# Altium schematic sheet PWR.SchDoc: USB_HUB 3.0
size A1; DrawnBy: Luca Schenetti; Revision: A; SheetNumber: 2; SheetTotal: 10
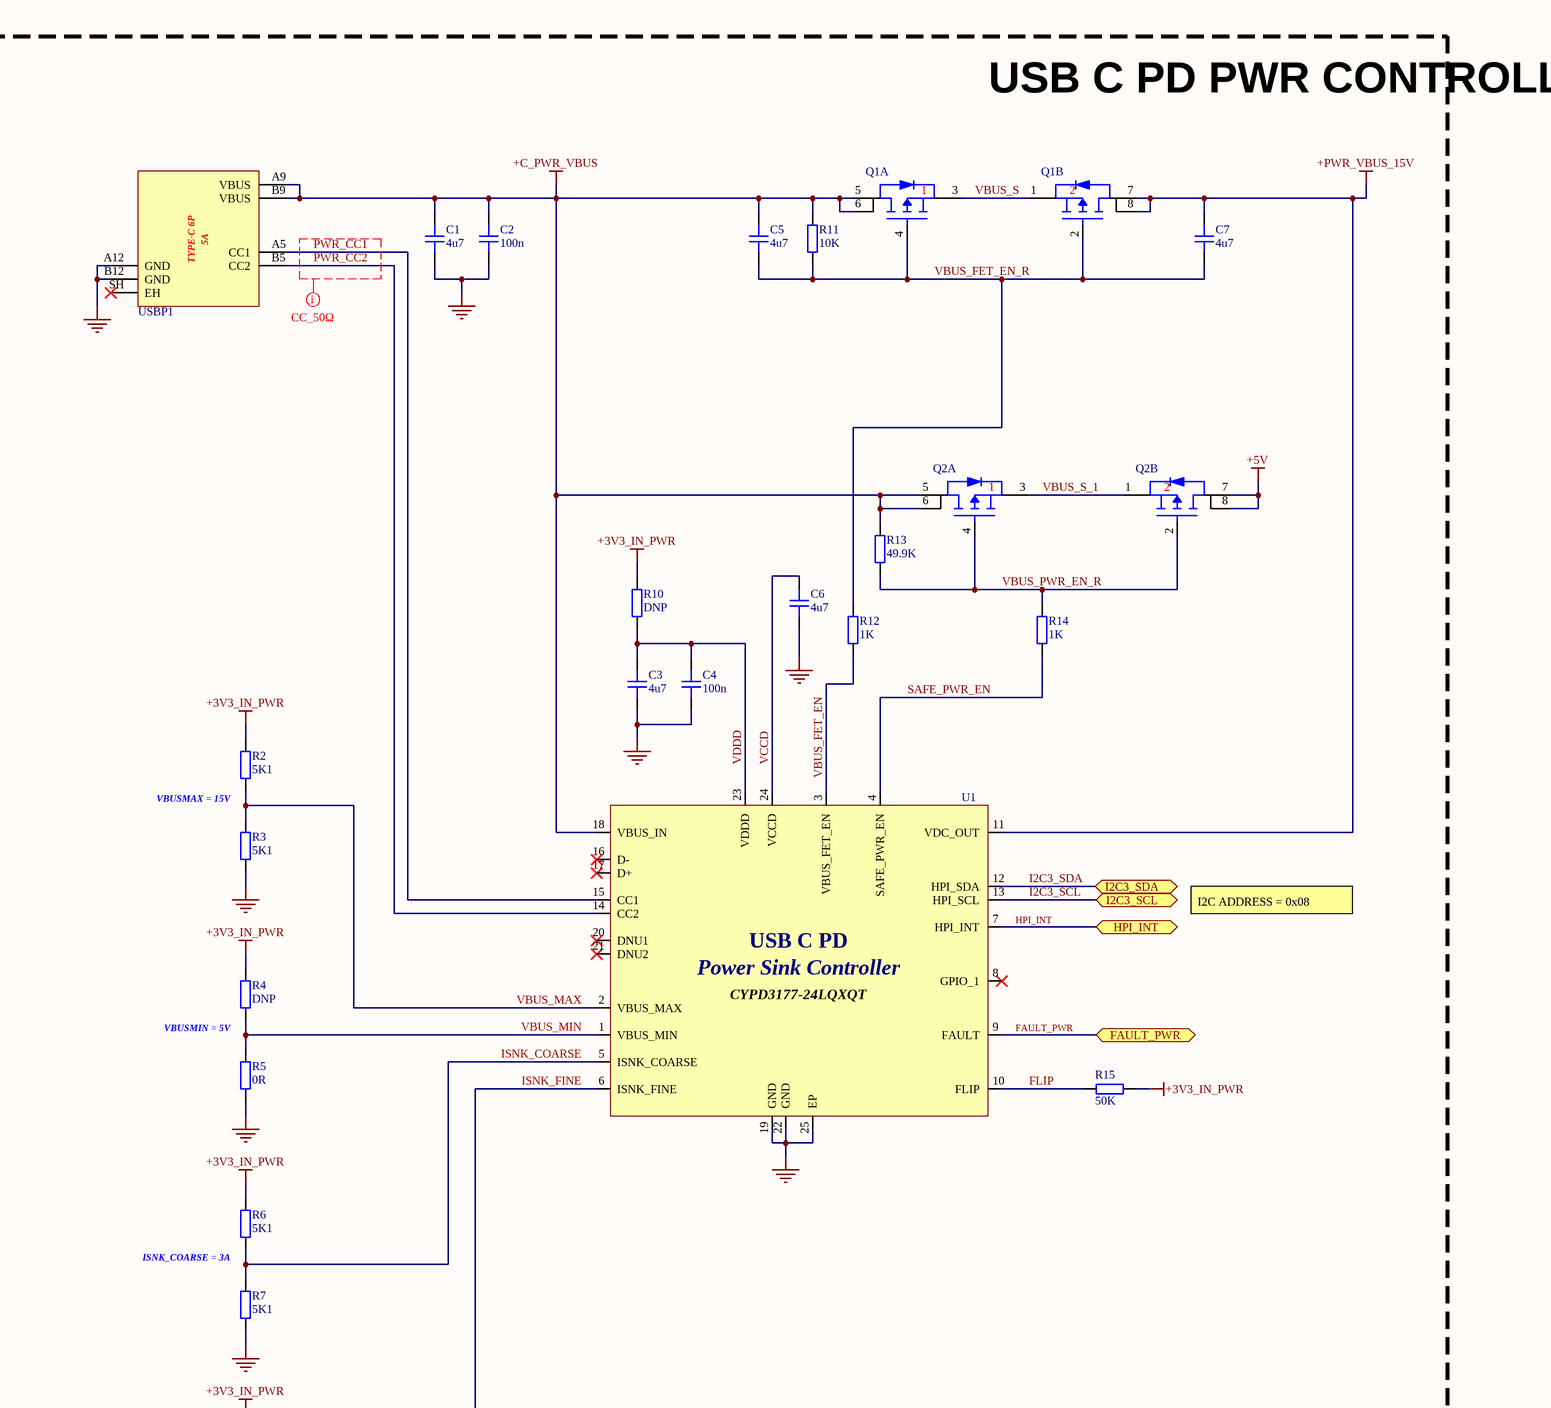
[diagram p0: PWR.SchDoc, top left]
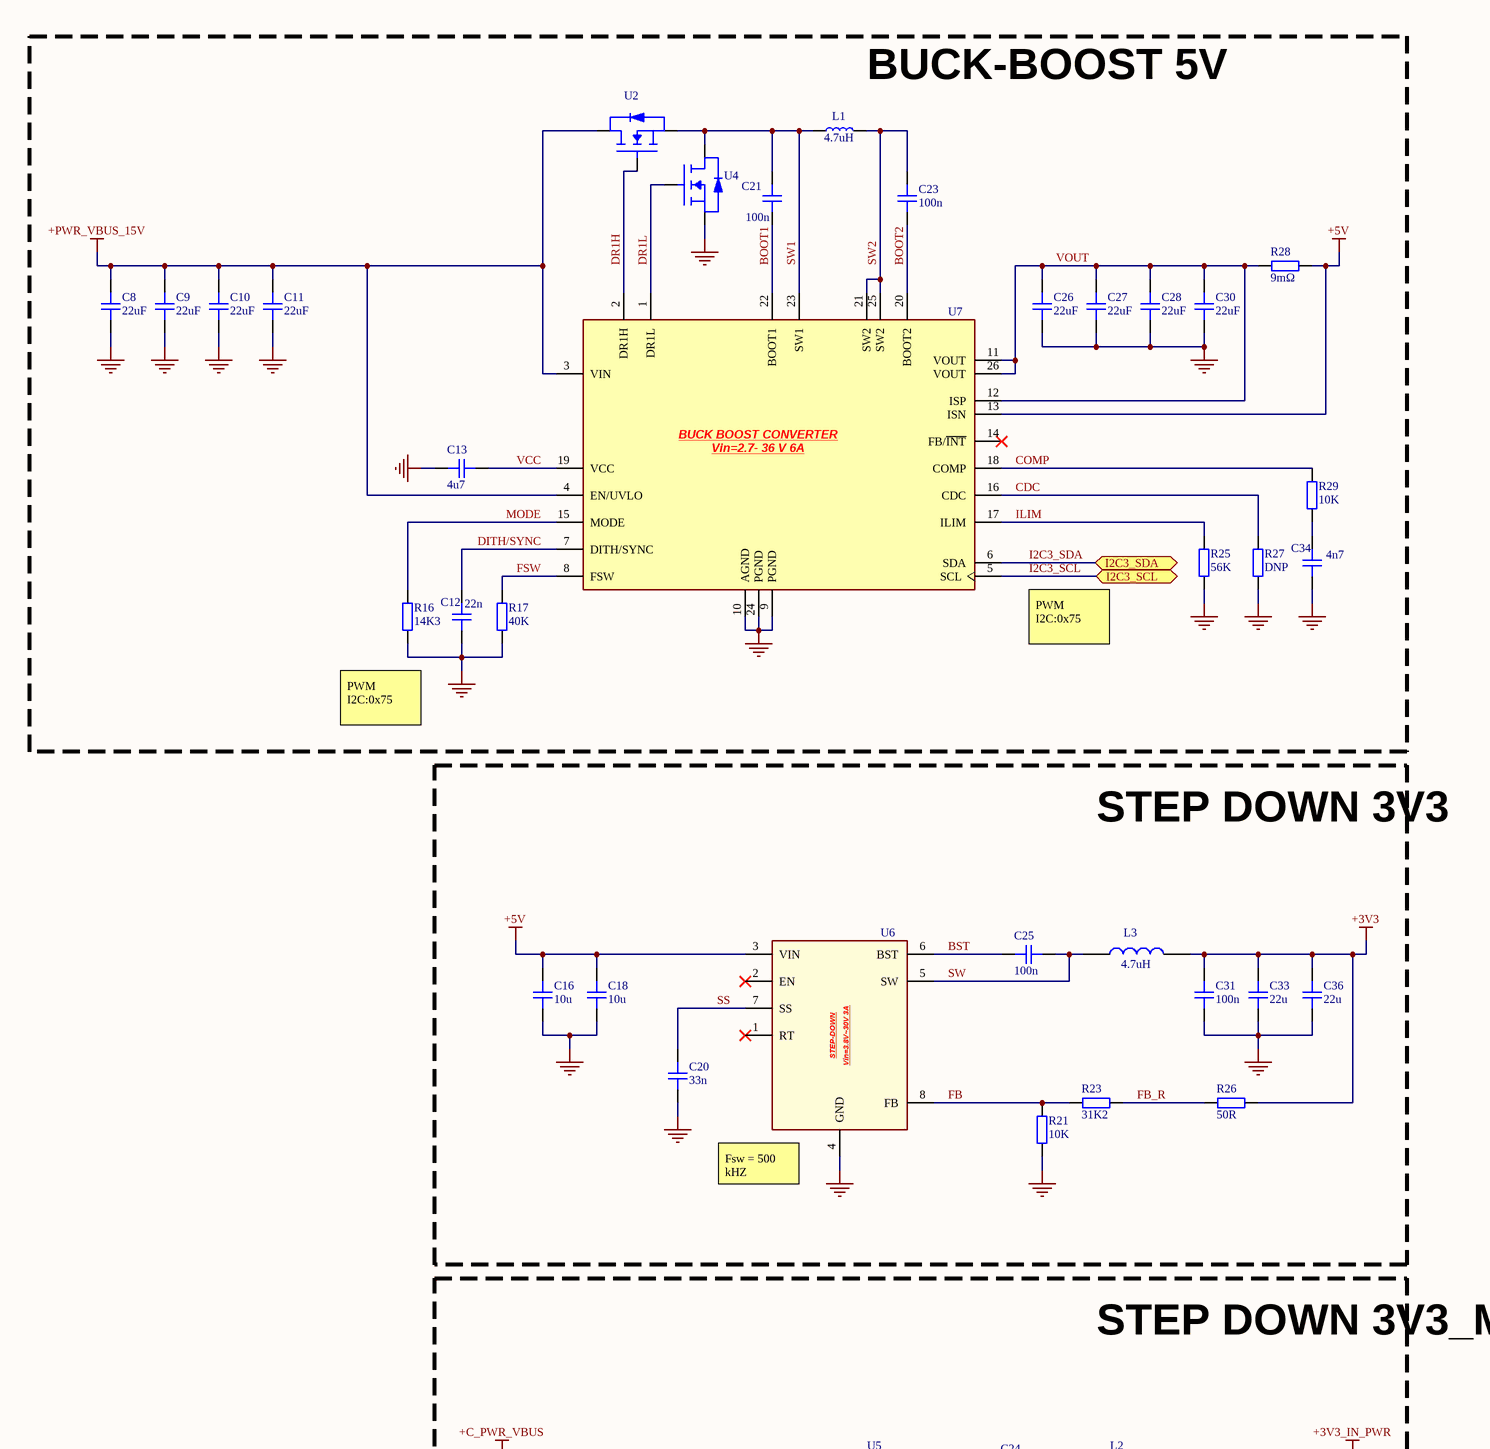
[diagram p1: PWR.SchDoc, top right]
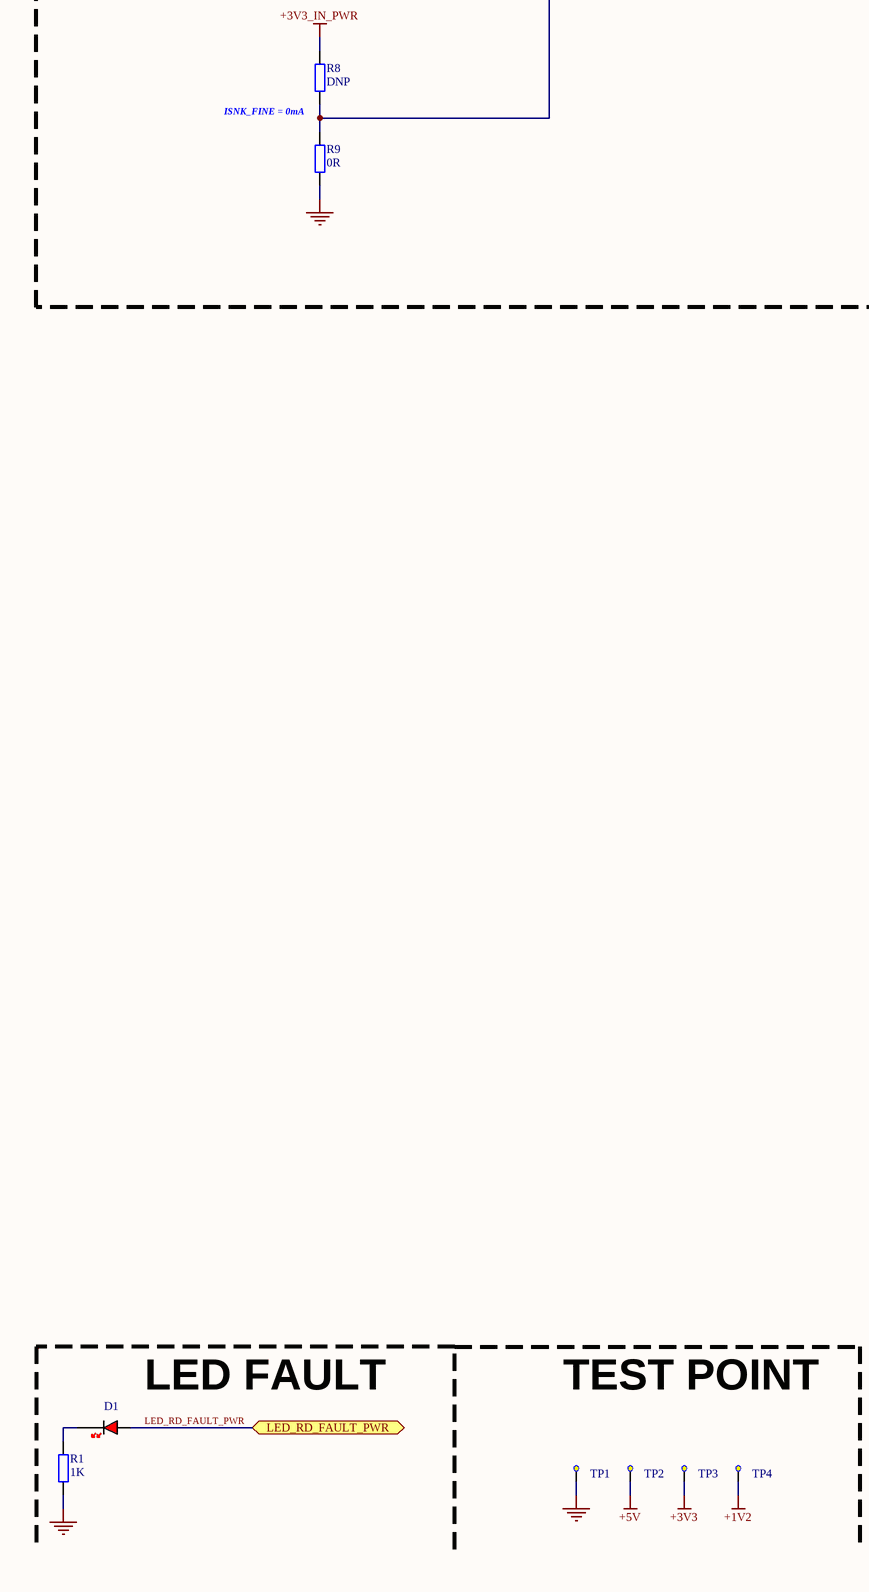
[diagram p2: PWR.SchDoc, bottom left]
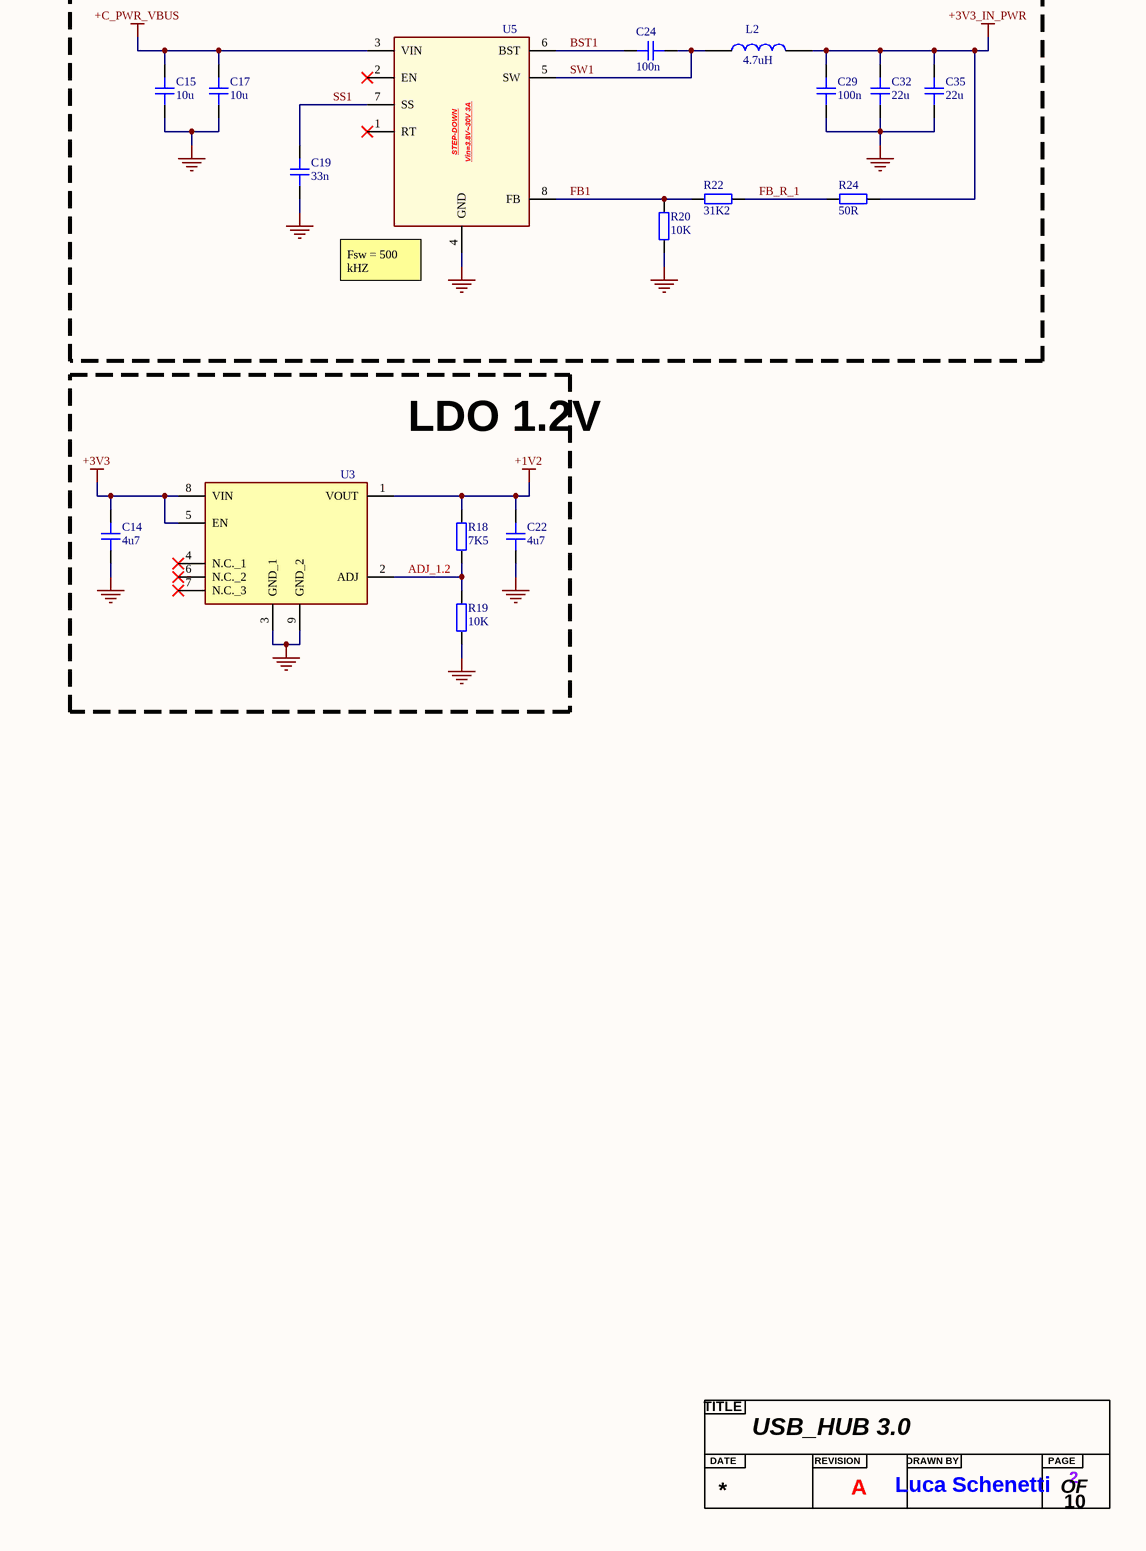
[diagram p3: PWR.SchDoc, bottom right]

## Parts
?  Title  (value not drawn)  (graphical)
C1  4u7  [CAP_0805]
C2  100n  [CAP_0603]
C3  4u7  [CAP_0603]
C4  100n  [CAP_0603]
C5  4u7  [CAP_0805]
C6  4u7  [CAP_0603]
C7  4u7  [CAP_0805]
C8  22uF  [CAP_0805]
C9  22uF  [CAP_0805]
C10  22uF  [CAP_0805]
C11  22uF  [CAP_0805]
C12  22n  [CAP_0603]
C13  4u7  [CAP_0603]
C14  4u7  [CAP_0603]
C15  10u  [CAP_0805]
C16  10u  [CAP_0805]
C17  10u  [CAP_0805]
C18  10u  [CAP_0805]
C19  33n  [CAP_0603]
C20  33n  [CAP_0603]
C21  100n  [CAP_0603]
C22  4u7  [CAP_0603]
C23  100n  [CAP_0603]
C24  100n  [CAP_0603]
C25  100n  [CAP_0603]
C26  22uF  [CAP_0805]
C27  22uF  [CAP_0805]
C28  22uF  [CAP_0805]
C29  100n  [CAP_0603]
C30  22uF  [CAP_0805]
C31  100n  [CAP_0603]
C32  22u  [CAP_0603]
C33  22u  [CAP_0603]
C34  4n7  [CAP_0603]
C35  22u  [CAP_0603]
C36  22u  [CAP_0603]
D1  RED  [LED_0603_RED]  (value not drawn)
L1  4.7uH  [XR0850-4R7M]
L2  4.7uH  [FXL0530-4R7-M]
L3  4.7uH  [FXL0530-4R7-M]
Q1  AO4805  [SOIC-8]  (value not drawn)  (parts A,B of 2)
Q2  AO4805  [SOIC-8]  (value not drawn)  (parts A,B of 2)
R1  1K  [RES_0402]
R2  5K1  [RES_0603]
R3  5K1  [RES_0603]
R4  DNP  [RES_0603]  (no BOM)
R5  0R  [RES_0603]
R6  5K1  [RES_0603]
R7  5K1  [RES_0603]
R8  DNP  [RES_0603]  (no BOM)
R9  0R  [RES_0603]
R10  DNP  [RES_0603]  (no BOM)
R11  10K  [RES_0603]
R12  1K  [RES_0603]
R13  49.9K  [RES_0603]
R14  1K  [RES_0603]
R15  50K  [RES_0603]
R16  14K3  [RES_0603]
R17  40K  [RES_0603]
R18  7K5  [RES_0603]
R19  10K  [RES_0603]
R20  10K  [RES_0603]
R21  10K  [RES_0603]
R22  31K2  [RES_0603]
R23  31K2  [RES_0603]
R24  50R  [RES_0603]
R25  56K  [RES_0603]
R26  50R  [RES_0603]
R27  DNP  [RES_0603]  (no BOM)
R28  9mΩ  [RES_1206]
R29  10K  [RES_0603]
TP1  Test Point  [Test Point]  (value not drawn)
TP2  Test Point  [Test Point]  (value not drawn)
TP3  Test Point  [Test Point]  (value not drawn)
TP4  Test Point  [Test Point]  (value not drawn)
U1  Power Sink Controller  [CYPD3177-24LQXQT]  (value not drawn)
U2  Mosfet N-Channel  Vgs=20V Id=48A  [AON6220]  (value not drawn)
U3  LDO ADJ 2A  [MD7672B50SF4]  (value not drawn)
U4  Mosfet N-Channel  Vgs=20V Id=48A  [AON6220]  (value not drawn)
U5  Step Down Converter 3A 3.8V~30V  [TPS62933DRLR]  (value not drawn)
U6  Step Down Converter 3A 3.8V~30V  [TPS62933DRLR]  (value not drawn)
U7  Buck-Boost Converter 6.35 A  [TPS55288RPMR]  (value not drawn)
USBP1  USB Type-C 5A 6P  [USB-TYPE-C-009]  (value not drawn)

## Blocks framed on the sheet
USB C PD PWR CONTROLLER: C1-C7 Q1 Q2 R2-R15 U1 USBP1
BUCK-BOOST 5V: C8-C13 C21 C23 C26-C28 C30 C34 L1 R16 R17 R25 R27-R29 U2 U4 U7
STEP DOWN 3V3: C16 C18 C20 C25 C31 C33 C36 L3 R21 R23 R26 U6
STEP DOWN 3V3_MCU: C15 C17 C19 C24 C29 C32 C35 L2 R20 R22 R24 U5
LDO 1.2V: C14 C22 R18 R19 U3

## Ports
FAULT_PWR (bidir, see MCU[2D]), HPI_INT (bidir, see MCU[2C]), I2C3_SCL (bidir, see MCU[2C], PWR[4B], USB_HUB1 DN PORT 1_2[5B], USB_HUB1 DN PORT 1_2[5D], USB_HUB1 UP PORT0[5B]), I2C3_SCL (bidir, see MCU[2C], PWR[11A], USB_HUB1 DN PORT 1_2[5B], USB_HUB1 DN PORT 1_2[5D], USB_HUB1 UP PORT0[5B]), I2C3_SDA (bidir, see MCU[4C], PWR[4B], USB_HUB1 DN PORT 1_2[5B], USB_HUB1 DN PORT 1_2[5D], USB_HUB1 UP PORT0[5B]), I2C3_SDA (bidir, see MCU[4C], PWR[11A], USB_HUB1 DN PORT 1_2[5B], USB_HUB1 DN PORT 1_2[5D], USB_HUB1 UP PORT0[5B]), LED_RD_FAULT_PWR (bidir, see MCU[1D])

## Nets
+1V2: C22.2 R18.2 TP4.1(Test_Point) U3.1(VOUT)
+3V3: C14.2 C31.1 C33.2 C36.2 L3.2 R26.1 TP3.1(Test_Point) U3.5(EN) U3.8(VIN)
+3V3_IN_PWR: C29.1 C32.2 C35.2 L2.2 R2.2 R4.2 R6.2 R8.2 R10.2 R15.2 R24.1
+5V: C16.2 C18.2 Q2.7(D2) Q2.8(D2) R28.2 TP2.1(Test_Point) U6.3(VIN) U7.13(ISN)
+C_PWR_VBUS: C1.2 C2.2 C5.2 C15.2 C17.2 Q1.5(D1) Q1.6(D1) Q2.5(D1) Q2.6(D1) R11.2 R13.2 U1.18(VBUS_IN) U5.3(VIN) USBP1.A9(VBUS) USBP1.B9(VBUS)
+PWR_VBUS_15V: C7.2 C8.2 C9.2 C10.2 C11.2 Q1.7(D2) Q1.8(D2) U1.11(VDC_OUT) U2.D U7.3(VIN) U7.4(EN/UVLO)
GND: C1.1 C2.1 C3.1 C4.1 C6.1 C8.1 C9.1 C10.1 C11.1 C12.1 C13.2 C14.1 C15.1 C16.1 C17.1 C18.1 C19.2 C20.2 C22.1 C26.1 C27.1 C28.1 C29.2 C30.1 C31.2 C32.1 C33.1 C34.1 C35.1 C36.1 R1.1 R3.1 R5.1 R7.1 R9.1 R16.1 R17.1 R19.1 R20.1 R21.1 R25.1 R27.1 TP1.1(Test_Point) U1.19(GND) U1.22(GND) U1.25(EP) U3.3(GND_1) U3.9(GND_2) U4.S U5.4(GND) U6.4(GND) U7.9(PGND) U7.10(AGND) U7.24(PGND) USBP1.A12(GND) USBP1.B12(GND)
ADJ_1.2: R18.1 R19.2 U3.2(ADJ)
BOOT1: C21.1 U7.22(BOOT1)
BOOT2: C23.1 U7.20(BOOT2)
BST: C25.2 U6.6(BST)
BST1: C24.2 U5.6(BST)
CDC: R27.2 U7.16(CDC)
COMP: R29.2 U7.18(COMP)
DITH/SYNC: C12.2 U7.7(DITH/SYNC)
DR1H: U2.G U7.2(DR1H)
DR1L: U4.G U7.1(DR1L)
FAULT_PWR: U1.9(FAULT) ; port FAULT_PWR
FB: R21.2 R23.2 U6.8(FB)
FB1: R20.2 R22.2 U5.8(FB)
FB_R: R23.1 R26.2
FB_R_1: R22.1 R24.2
FLIP: R15.1 U1.10(FLIP)
FSW: R17.2 U7.8(FSW)
HPI_INT: U1.7(HPI_INT) ; port HPI_INT
I2C3_SCL: U1.13(HPI_SCL) U7.5(SCL) ; port I2C3_SCL
I2C3_SDA: U1.12(HPI_SDA) U7.6(SDA) ; port I2C3_SDA
ILIM: R25.2 U7.17(ILIM)
ISNK_COARSE: R6.1 R7.2 U1.5(ISNK_COARSE)
ISNK_FINE: R8.1 R9.2 U1.6(ISNK_FINE)
LED_RD_FAULT_PWR: D1.A ; port LED_RD_FAULT_PWR
MODE: R16.2 U7.15(MODE)
PWR_CC1: U1.15(CC1) USBP1.A5(CC1)
PWR_CC2: U1.14(CC2) USBP1.B5(CC2)
SAFE_PWR_EN: R14.1 U1.4(SAFE_PWR_EN)
SS: C20.1 U6.7(SS)
SS1: C19.1 U5.7(SS)
SW: C25.1 L3.1 U6.5(SW)
SW1: C21.2 C24.1 L1.1 L2.1 U2.S U4.D U5.5(SW) U7.23(SW1)
SW2: C23.2 L1.2 U7.21(SW2) U7.25(SW2)
VBUS_FET_EN: R12.1 U1.3(VBUS_FET_EN)
VBUS_FET_EN_R: C5.1 C7.1 Q1.2(G2) Q1.4(G1) R11.1 R12.2
VBUS_MAX: R2.1 R3.2 U1.2(VBUS_MAX)
VBUS_MIN: R4.1 R5.2 U1.1(VBUS_MIN)
VBUS_PWR_EN_R: Q2.2(G2) Q2.4(G1) R13.1 R14.2
VBUS_S: Q1.1(S2) Q1.3(S1)
VBUS_S_1: Q2.1(S2) Q2.3(S1)
VCC: C13.1 U7.19(VCC)
VCCD: C6.2 U1.24(VCCD)
VDDD: C3.2 C4.2 R10.1 U1.23(VDDD)
VOUT: C26.2 C27.2 C28.2 C30.2 R28.1 U7.11(VOUT) U7.12(ISP) U7.26(VOUT)
NetC34_2: C34.2 R29.1
NetD1_K: D1.K R1.2

Not connected (* = marked no-connect by the designer): U1 8(GPIO_1)* 16(D-)* 17(D+)* 20(DNU1)* 21(DNU2)*; U3 4(N.C._1)* 6(N.C._2)* 7(N.C._3)*; U5 1(RT)* 2(EN)*; U6 1(RT)* 2(EN)*; U7 14(FB/~{INT})*; USBP1 SH(EH)*

## Layout directives
net class CC_50Ω: PWR_CC1, PWR_CC2

## Notes on the sheet
- PWM
  I2C:0x75
- VBUSMAX = 15V
- I2C ADDRESS = 0x08
- VBUSMIN = 5V
- (near U6) Fsw = 500 kHZ
- ISNK_COARSE = 3A
- ISNK_FINE = 0mA
- (near U5) Fsw = 500 kHZ
- (near D1) LED FAULT
- TEST POINT
- (in symbol CYPD3177-24LQXQT) USB C PD
- (in symbol Title) TITLE; DATE; REVISION; DRAWN BY; PAGE; OF
- (in symbol TPS55288RPMR) BUCK BOOST CONVERTER; Vin=2.7- 36 V 6A
- (in symbol TPS62933DRLR) STEP-DOWN; Vin=3.8V~30V 3A
- (in symbol USB-TYPE-C-009) TYPE-C 6P; 5A

## Library data of the parts
C1 C5 C7 = CAP_0805: [C1779]; Manufacturer: *; Manufacturer Part Number: *; Distributor Link: *; LCSC: *; Rating: *; Dielectric: *
C2 C4 C21 C23 = CAP_0603: [C14663]; Manufacturer: *; Manufacturer Part Number: *; Distributor Link: *; LCSC: *; Rating: *; Dielectric: *
C3 C13 C14 C22 = CAP_0603: [C19666]; Manufacturer: *; Manufacturer Part Number: *; Distributor Link: *; LCSC: *; Rating: *; Dielectric: *
C6 = CAP_0603: [C69335]; Manufacturer: *; Manufacturer Part Number: *; Distributor Link: *; LCSC: *; Rating: *; Dielectric: *
C8-C11 C26-C28 C30 = CAP_0805: [C45783]; Manufacturer: *; Manufacturer Part Number: *; Distributor Link: *; LCSC: *; Rating: *; Dielectric: *
C12 = CAP_0603: [C21122]; Manufacturer: *; Manufacturer Part Number: *; Distributor Link: *; LCSC: *; Rating: *; Dielectric: *
C15-C18 = CAP_0805: Capacitor SMD 0805[C440198]; Manufacturer: *; Manufacturer Part Number: *; Distributor Link: *; LCSC: *; Rating: *; Dielectric: *
C19 C20 = CAP_0603: [C21117]; Manufacturer: *; Manufacturer Part Number: *; Distributor Link: *; LCSC: *; Rating: *; Dielectric: *
C24 C25 C29 C31 = CAP_0603: Capacitor SMD 0603 [C14663]; Manufacturer: *; Manufacturer Part Number: *; Distributor Link: *; LCSC: *; Rating: *; Dielectric: *
C32 C33 C35 C36 = CAP_0603: Capacitor SMD 0603 [C59461]; Manufacturer: *; Manufacturer Part Number: *; Distributor Link: *; LCSC: *; Rating: *; Dielectric: *
C34 = CAP_0603: [C53987]; Manufacturer: *; Manufacturer Part Number: *; Distributor Link: *; LCSC: *; Rating: *; Dielectric: *
D1 = LED_0603_RED: LED 0603 RED SMD[C2926776]
L1 = XR0850-4R7M: [C7498934]
L2 L3 = FXL0530-4R7-M: [C177246]
Q1 Q2 = AO4805: [C5224317]; Manufacturer: Alpha & Omega Semicon; Manufacturer Part Number: AO4805; LCSC: C38943
R1 = RES_0402: [C11702]; Manufacturer: *; Manufacturer Part Number: *; Distributor Link: *; LCSC: *
R2 R3 R6 R7 = RES_0603: [C23186]; Manufacturer: *; Manufacturer Part Number: *; Distributor Link: *; LCSC: *
R4 R8 R10 R27 = RES_0603: Manufacturer: *; Manufacturer Part Number: *; Distributor Link: *; LCSC: *
R5 R9 = RES_0603: [C21189]; Manufacturer: *; Manufacturer Part Number: *; Distributor Link: *; LCSC: *
R11 R19-R21 R29 = RES_0603: [C25804]; Manufacturer: *; Manufacturer Part Number: *; Distributor Link: *; LCSC: *
R12 R14 = RES_0603: [C21190]; Manufacturer: *; Manufacturer Part Number: *; Distributor Link: *; LCSC: *
R13 = RES_0603: [C23184]; Manufacturer: *; Manufacturer Part Number: *; Distributor Link: *; LCSC: *
R15 = RES_0603: [C861451]; Manufacturer: *; Manufacturer Part Number: *; Distributor Link: *; LCSC: *
R16 = RES_0603: [C2933145]; Manufacturer: *; Manufacturer Part Number: *; Distributor Link: *; LCSC: *
R17 = RES_0603: [C3016445]; Manufacturer: *; Manufacturer Part Number: *; Distributor Link: *; LCSC: *
R18 = RES_0603: [C23234]; Manufacturer: *; Manufacturer Part Number: *; Distributor Link: *; LCSC: *
R22 R23 = RES_0603: [C863036]; Manufacturer: *; Manufacturer Part Number: *; Distributor Link: *; LCSC: *
R24 R26 = RES_0603: [C849792]; Manufacturer: *; Manufacturer Part Number: *; Distributor Link: *; LCSC: *
R25 = RES_0603: [C23206]; Manufacturer: *; Manufacturer Part Number: *; Distributor Link: *; LCSC: *
R28 = RES_1206: [C2904216]; Manufacturer: *; Manufacturer Part Number: *; Distributor Link: *; LCSC: *
U1 = CYPD3177-24LQXQT: [C5904158]; Manufacturer: Cypress Semicon; Manufacturer Part Number: CYPD3177-24LQXQ; Distributor Link: https://www.lcsc.com/product-detail/USB-ICs_Cypress-Semicon-CYPD3177-24LQXQ_C2959321.html
U2 U4 = AON6220: [C2997886]
U3 = MD7672B50SF4: [C920526]
U5 U6 = TPS62933DRLR: [C3200405]
U7 = TPS55288RPMR: [C2864583]
USBP1 = USB-TYPE-C-009: [C2927029]
TP1-TP4 = Test Point: Value: Test Point